# Altium schematic sheet 1_Channel_Opto_Relay.SchDoc
size A4; SheetNumber: 2; SheetTotal: 2
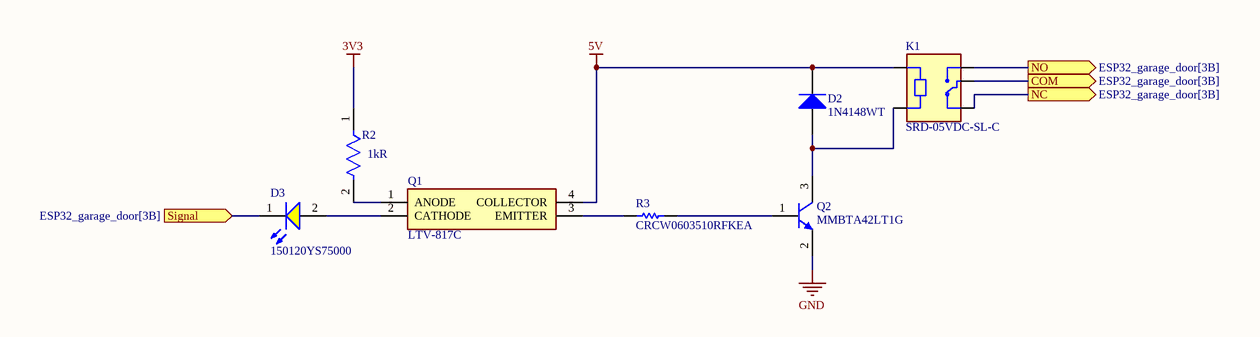
[diagram p0: 1_Channel_Opto_Relay.SchDoc]

## Parts
D2  1N4148WT  [FAIR-SOD-523F-2_V]
D3  150120YS75000  [WL-SMCW_1206_150120xx75000]
K1  SRD-05VDC-SL-C  [RELAY_SRD-05VDC-SL-C]
Q1  LTV-817C  [DIP762W60P254L460H450Q4N]
Q2  MMBTA42LT1G  [ONSC-SOT-23-3-318-08_V]
R2  Resistance: 1kR  [FP-AC0603-IPC_B]  (hidden comment: AC0603FR-071KL)
R3  CRCW0603510RFKEA  [RESC1609X50X30NL10T20]

## Ports
COM (out, see ESP32_garage_door[3B]), NC (out, see ESP32_garage_door[3B]), NO (out, see ESP32_garage_door[3B]), Signal (in, see ESP32_garage_door[3B])

## Nets
3V3: R2.1
5V: D2.1(K) K1.A1 Q1.4(COLLECTOR)
GND: Q2.2(E)
COM: K1.COM ; port COM
NC: K1.NC ; port NC
NO: K1.NO ; port NO
Signal: D3.1(K) ; port Signal
NetD2_2: D2.2(A) K1.A2 Q2.3(C)
NetD3_2: D3.2(A) Q1.2(CATHODE)
NetQ1_1: Q1.1(ANODE) R2.2
NetQ1_3: Q1.3(EMITTER) R3.1
NetQ2_1: Q2.1(B) R3.2

## Library data of the parts
D2 = CMP-0881-00001-1: High Conductance Fast Switching Diode, 75 V, -55 to 150 degC, 2-Pin SOD523F, RoHS; Manufacturer: Fairchild Semiconductor; IR (VR: 75 V)=5 uA Max.; VF: 1 V Max.; BVR (IR: 5 uA)=75 V Min.; CO: 4 pF Max.; DatasheetVersion: Rev. A2; ComponentLink1Description: Manufacturer URL; PackageDescription: 2-Pin Surface Mount Device, Body 1.2 x 0.8 mm, Height 0.7 mm; ComponentLink2URL: http://www.fairchildsemi.com/ds/1N/1N4148WT.pdf; ComponentLink2Description: Datasheet; PartNumber: 1N4148WT; ComponentLink1URL: http://www.fairchildsemi.com/; Temperature Range: -55 to 150 degC; Mounting Technology: Surface Mount; PackageReference: SOD-523F-2; RoHS: TRUE
D3 = CMP-1426-00019-3: Led, Yellow, 590 Nm, 2 V, 30 Ma, 120 Mcd Rohs Compliant: Yes; Dominant Wavelength: 590nm; Forward Voltage: 2V; Forward Current: 100mA; Viewing Angle: 140°; Max Reverse Voltage (DC): 5V; Peak Wavelength: 595nm; Lens Style: Clear, Rectangular; Test Current: 20mA; Luminous Intensity: 120mcd; REACH SVHC: Unknown; Length: 3.2mm; RoHS: Compliant; Packaging: Tape and Reel; Min Operating Temperature: -40°C; Mount: Surface Mount; Max Operating Temperature: 85°C; Wavelength: 590nm; Case/Package: 1206; Case Code (Imperial): 1206; Color: Yellow; Height: 680µm; Case Code (Metric): 3216; Width: 1.6mm
K1 = CMP-003-000000-1: 5V Trigger Relay Module For Arduino And Raspberry Pi 5V Trigger Relay Module For Arduino And Raspberry Pi; MF: Songle Relay; Package: NON STANDARD-5 Songle Relay; Design Item ID: SRD-05VDC-SL-C; MP: SRD-05VDC-SL-C; Pin Count: 5; Price: None; Source: SRD-05VDC-SL-C.SchLib; Availability: Not in stock; Check_prices: https://www.snapeda.com/parts/SRD-05VDC-SL-C/Songle+Relay/view-part/?ref=eda; Value: *; Component Type: Standard; SnapEDA_Link: https://www.snapeda.com/parts/SRD-05VDC-SL-C/Songle+Relay/view-part/?ref=snap
Q1 = LTV-817C: Phototransistor; Manufacturer_Name: Lite-On; Datasheet Link: https://optoelectronics.liteon.com/upload/download/DS-70-96-0016/LTV-8X7%20series%20201610%20.pdf; Height: 4.5mm; Manufacturer_Part_Number: LTV-817C; Mouser Part Number: 859-LTV-817C; Mouser Price/Stock: https://www.mouser.co.uk/ProductDetail/Lite-On/LTV-817C?qs=WAWaI72GHKzVL8VAYU18sA%3D%3D; Arrow Part Number: LTV-817C; Arrow Price/Stock: https://www.arrow.com/en/products/ltv-817-c/lite-on-technology?utm_currency=USD&region=europe
Q2 = CMP-1048-00662-1: High Voltage Transistor, NPN Silicon, 3-Pin SOT-23, Pb-Free, Tape and Reel; Manufacturer: On Semiconductor; fT Min (MHz): 50; IC Continuous (A): 0.5; ComponentLink1URL: http://www.onsemi.com/; ComponentLink3URL: http://www.onsemi.cn/pub_link/Collateral/318-08.PDF; RoHS: TRUE; ComponentLink2Description: Datasheet; PartNumber: MMBTA42LT1G; Polarity: NPN; DatasheetVersion: Rev. 12; PackageReference: SOT-23-3-318-08; PackageDescription: 3-Pin Small Outline Transistor, Body 2.92 x 1.3 mm, Pitch 0.95 mm; ComponentLink3Description: Package Specification; ComponentLink1Description: Manufacturer URL; Packing: Tape and Reel; PackageVersion: Rev. AP, 11/2009; Mounting Technology: Surface Mount; ComponentLink2URL: http://www.onsemi.cn/pub_link/Collateral/MMBTA42LT1-D.PDF
R2 = CMP-2000-04828-3: RES 1kΩ 1.00% 0.1W 0603; Voltage Rating: 50V; Power Rating: 100mW; Tolerance: 1%; Temperature Coefficient: 100ppm/°C; Depth: 0.8mm; Case/Package: 0603; Size Code: 0603; Case Code (Metric): 1608; Height: 0.022inch; Series: AC; Width: 0.031inch; Construction: Rectangular; Length: 0.063inch; Case Code (Imperial): 0603; Package Quantity: 1; RoHS Compliant: Yes; Features: Moisture Resistant; Resistor Type: Thick Film; Max Power Dissipation: 100mW; Packaging: Tape and Reel; Termination: SMD/SMT; Ratings: AEC-Q200; Max Operating Temperature: 155°C; Min Operating Temperature: -55°C; Military Standard: Not; Lead Free: Lead Free; Number of Terminations: 2
R3 = CMP-2000-03439-1: Manufacturer: Vishay Dale; Part Number: CRCW0603510RFKEA